# EAGLE design amc7135-24mm-RGBW-led-driver-with-butt-mk-1.1 (EAGLE 7.5.0)
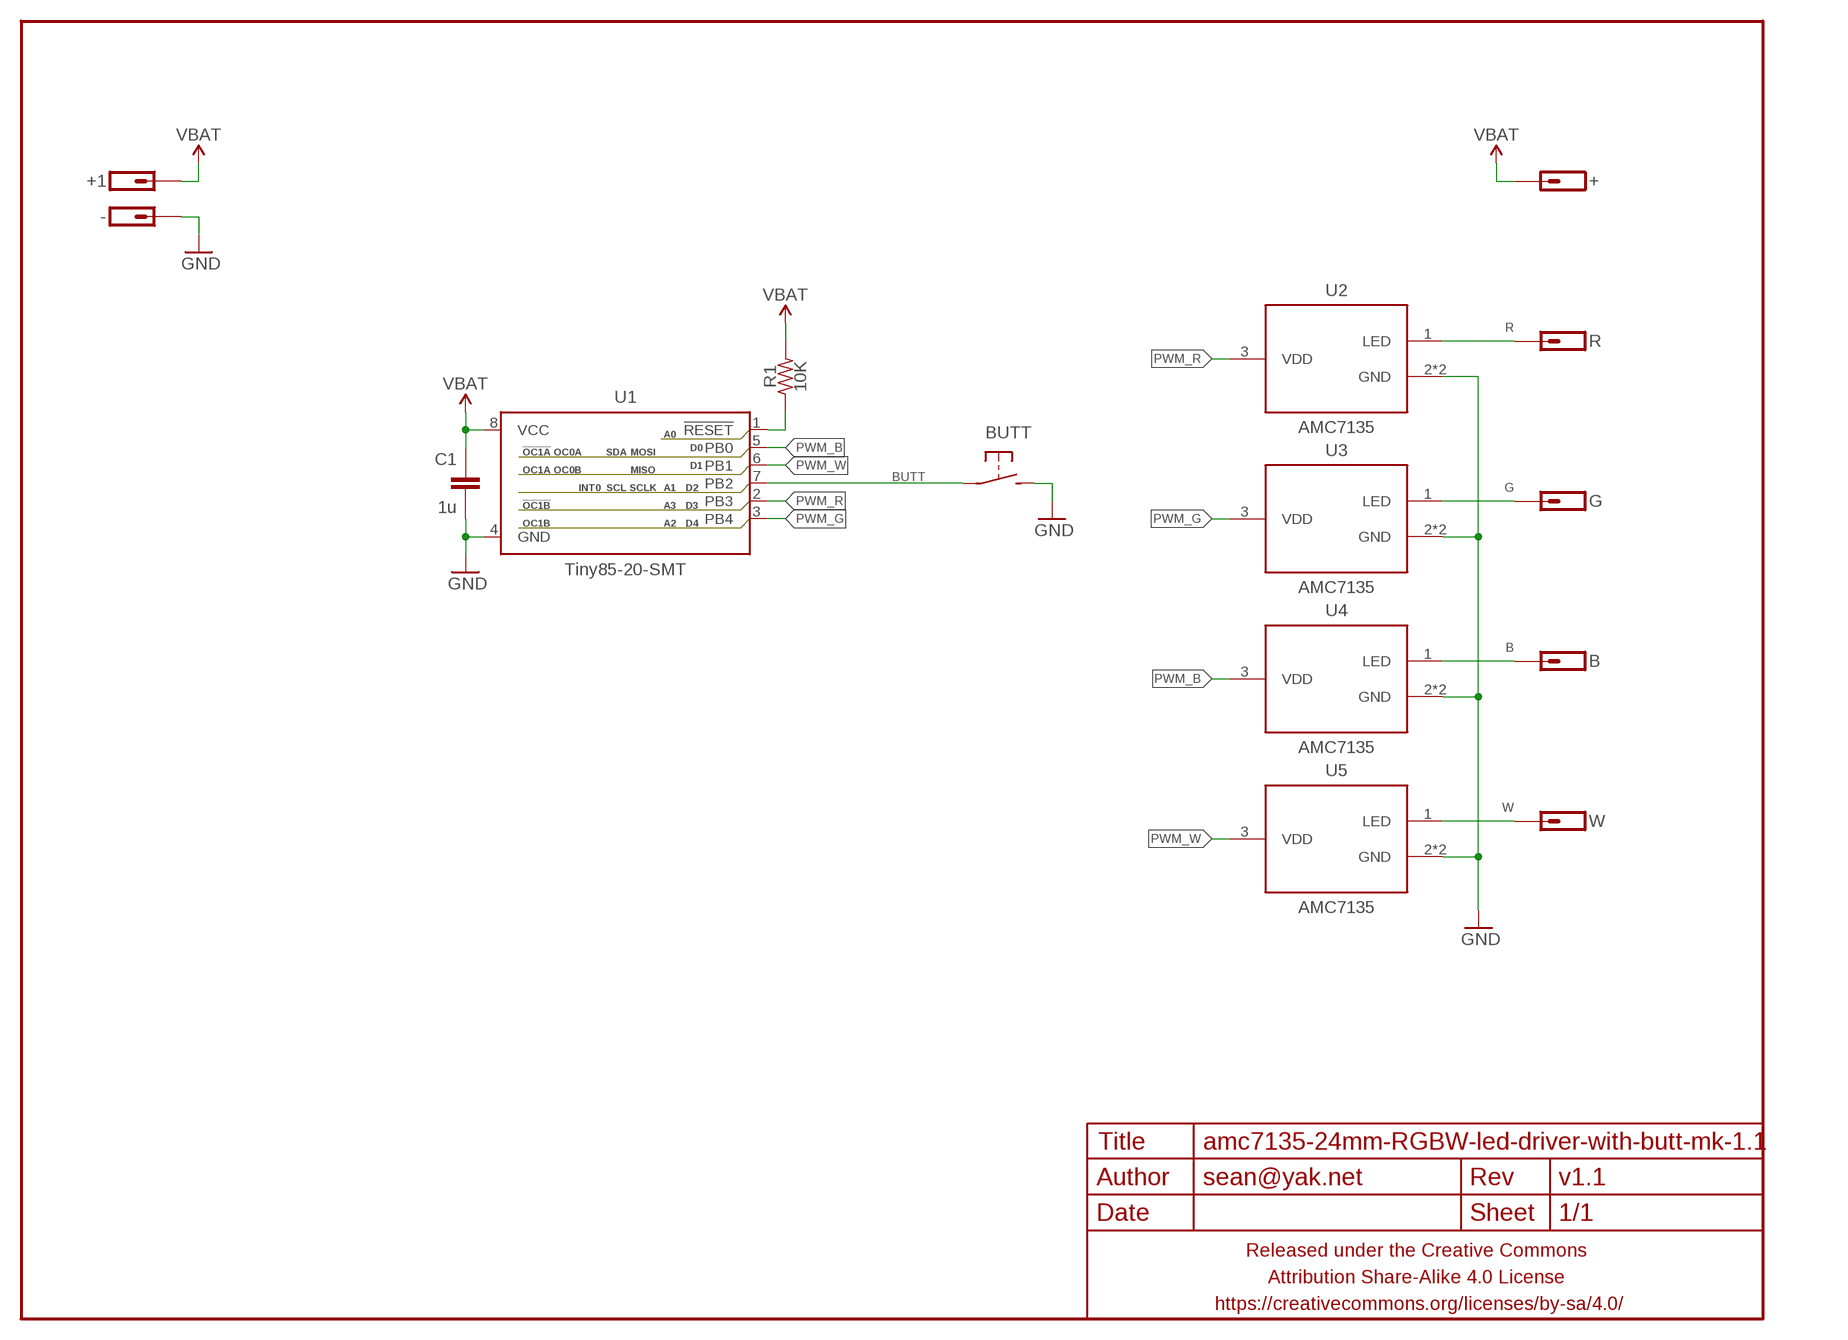
[diagram p0: schematic, sheet 1]

## Parts
+  M01PTH-1.2MM-NS  [1X01-1.2MM-NS]
+1  M01NOSTOP-CANTSTOP-DONTKNOWHOWTOSTOP  [1X01_SMD_NOSTOP_NOSILK]
-  M01NOT-A-VIA-NOPE  [1X01_NOSILK_NOSTOP]
B  M01SMD-1.25MM-DIA  [1X01-SMD-1.25MM-DIA-NS]
BUTT  SPST-NO-TACT3MM-RA  [TACTILE-PTH-SIDE]
C1  1u  CAPACITOR-CERAMICC0603-TIGHTER  [C0603-TIGHTER]
FRAME1  FRAME-LETTERNO_PACKAGE  [DUMMY]
G  M01SMD-1.25MM-DIA  [1X01-SMD-1.25MM-DIA-NS]
R  M01SMD-1.25MM-DIA  [1X01-SMD-1.25MM-DIA-NS]
R1  10K  RESISTORR0603-TIGHTER  [R0603-TIGHTER]
U1  Tiny85-20-SMT  ATTINY45TINY85-20-SOICW  [SO08-EIAJ]
U2  AMC7135  AMC7135SOT-89  [SOT89]
U3  AMC7135  AMC7135SOT-89  [SOT89]
U4  AMC7135  AMC7135SOT-89  [SOT89]
U5  AMC7135  AMC7135SOT-89  [SOT89]
W  M01SMD-1.25MM-DIA  [1X01-SMD-1.25MM-DIA-NS]

## Nets
B: B.P$1 U4.1(LED)
BUTT: BUTT.1 U1.7(PB2)
G: G.P$1 U3.1(LED)
GND: -.P$1 BUTT.2 C1.2 U1.4(GND) U2.2(GND) U2.4(GND) U3.2(GND) U3.4(GND) U4.2(GND) U4.4(GND) U5.2(GND) U5.4(GND)
N$4: R1.1 U1.1(!RESET)
PWM_B: U1.5(PB0) U4.3(VDD)
PWM_G: U1.3(PB4) U3.3(VDD)
PWM_R: U1.2(PB3) U2.3(VDD)
PWM_W: U1.6(PB1) U5.3(VDD)
R: R.P$1 U2.1(LED)
VBAT: +1.1 +.P$1 C1.1 R1.2 U1.8(VCC)
W: U5.1(LED) W.P$1

## Library data of the parts
+ +1 - B G R W = a_parts:M01: Header 1 Standard 1-pin 0.1" header. Use with straight break away headers (SKU : PRT-00116), right angle break away headers (PRT-00553), swiss pins (PRT-00743), machine pins (PRT-00117), and female headers (PRT-00115).
BUTT = a_parts:SPST-NO-TACT
C1 = a_parts:CAPACITOR-CERAMIC: CAPACITOR, European symbol
FRAME1 = a_parts:FRAME-LETTER: Schematic Frame Standard 8.5x11 US Letter frame; DESIGNER: sean@yak.net; VERSION: v1.1
R1 = a_parts:RESISTOR: RESISTOR, American symbol
U1 = a_parts:ATTINY45: Atmel 8-pin 2/4/8kB flash uC; PROD_ID: IC-09092
U2-U5 = a_parts:AMC7135

## Board
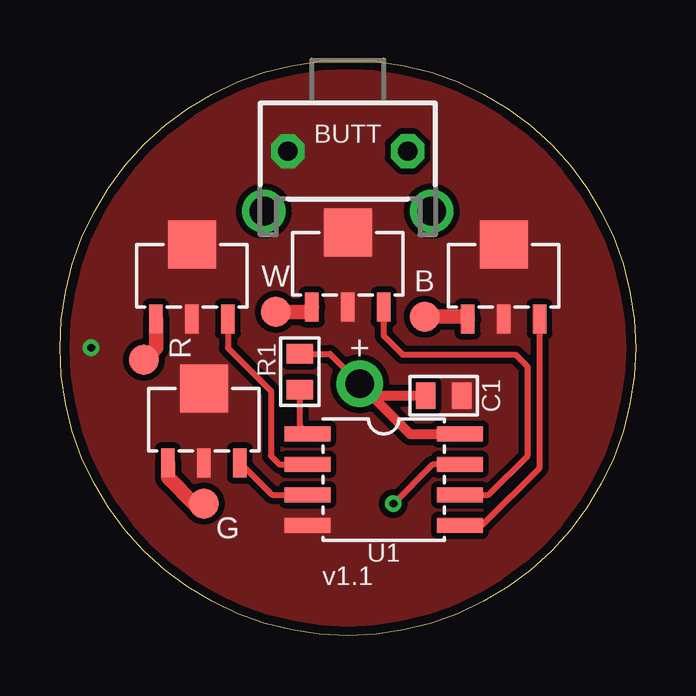
[diagram p1: board, top side]
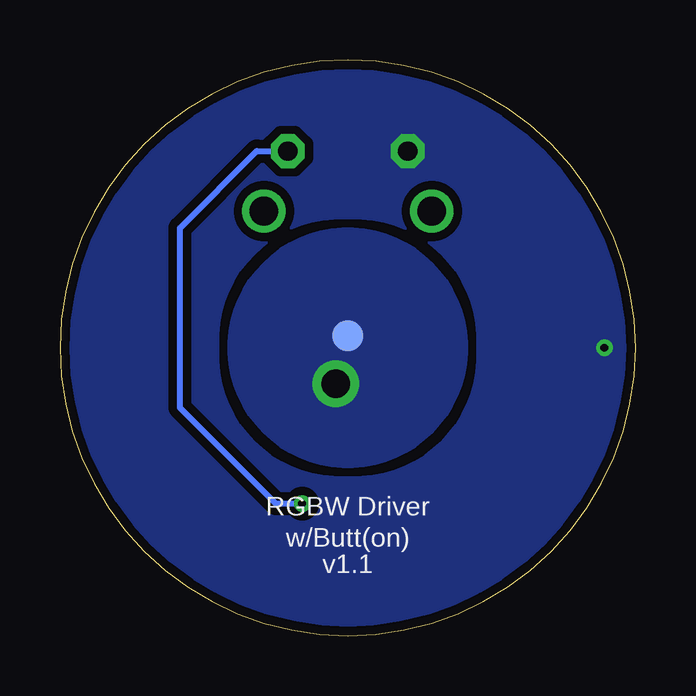
[diagram p2: board, bottom side, seen from below]

Size 24 x 24 mm. Coordinates in mm from the lower left corner, seen from the top.
Outline: 0,12 arc-180 24,12 arc-180 0,12
Copper layers (1*16): Top 0.0356mm / dielectric 1.5011mm / Bottom 0.0356mm
Design rules "LaenPCBOrder2": minimum track width 6mil, minimum drill 13mil, track to track 6mil, track to pad 6mil, pad to pad 6mil, via to via 6mil, smd to smd 6mil, copper to edge 15mil, drill to drill 6mil, minimum pad ring 7mil, minimum via ring 7mil, stop-mask expansion 3mil, vias tented up to drill 20mil, thermal gap 10mil

### Footprints (pad centres in the part's own frame; a part is rotated, then mirrored left to right if it is on the bottom)
1X01-1.2MM-NS = drill 1.2 pad 1.93: P$1 0,0
1X01_SMD_NOSTOP_NOSILK = smd 1.27 x 1.27: 1 0,0
1X01_NOSILK_NOSTOP = drill 0.33: P$1 0,0
1X01-SMD-1.25MM-DIA-NS = smd 1.25 x 1.25: P$1 0,0
TACTILE-PTH-SIDE = drill 0.8 pad 1.4 octagon: 1 -2.5,0; 2 2.5,0 | drill 1.2 pad 1.778: ANCHOR1 -3.5,2.5; ANCHOR2 3.5,2.5
C0603-TIGHTER = smd 0.8 x 1.1: 1 -0.75,0; 2 0.75,0
R0603-TIGHTER = smd 0.8 x 1.1: 1 -0.75,0; 2 0.75,0
SO08-EIAJ = smd 0.61 x 1.905: 1 -1.905,-3.175; 2 -0.635,-3.175; 3 0.635,-3.175; 4 1.905,-3.175; 5 1.905,3.175; 6 0.635,3.175; 7 -0.635,3.175; 8 -1.905,3.175
SOT89 = smd 0.58 x 1.2: 1 -1.5,-1.8; 2 0,-1.8; 3 1.5,-1.8 | smd 2 x 2: 4 0,1.3

### Placement (x,y rotation side)
+  12.5,10.5 90 top
+1  12,12.5 0 bottom
-  1.3,12 90 bottom
B  15.2,13.3 90 top
BUTT  12,20.2 180 top
C1  16,10 0 top
FRAME1  0,0 0 top
G  6,5.5 180 top
R  3.5,11.5 90 top
R1  10,11 90 top
U1  13.5,6.5 270 top
U2  5.5,15 0 top
U3  6,9 0 top
U4  18.5,15 0 top
U5  12,15.5 0 top
W  9,13.5 270 top

### Tracks (layer width: path | path; a pad name or v marks a point on that pad's centre or on a via)
B
  Top 0.6: U4.1 16.9,13.3 B.P$1
BUTT  (via drill 0.33)
  Top 0.254: U1.7 15.54,7.13 v13.9,5.5
  Bottom 0.254: v13.9,5.5 15,5.5 19,9.5 19,17 15.8,20.2 BUTT.1
G
  Top 0.6: U3.1 4.5,6.6 5.6,5.5 G.P$1
GND
  pour Top (isolate 0.25, rank 6, no thermals): 0,0 24,0 24,24 0,24
  pour Bottom (isolate 0.35, rank 6, no thermals): 0,0 0,24 24,24 24,0
N$4
  Top 0.254: U1.1 10,8.73 R1.1
PWM_B
  Top 0.254: U1.5 17.59,4.59 20,7 U4.3
PWM_G
  Top 0.254: U3.3 8.84,5.87 U1.3
PWM_R
  Top 0.254: U2.3 7,12 8.8,10.2 8.8,7.5 9.16,7.13 U1.2
PWM_W
  Top 0.254: U1.6 17.86,5.87 19.5,7.5 19.5,11.2 19,11.7 14.3,11.7 13.5,12.5 U5.3
R
  Top 0.6: U2.1 4,12 R.P$1
VBAT
  Top 0.254: R1.2 11.25,11.75 +.P$1
  Top 0.406: +.P$1 12.7,10.3 13,10 | 13,10 14.6,8.4 U1.8 | C1.1 13,10
  pour Bottom (isolate 0.305, no thermals): 8.5,15.5 arc-90 15.5,15.5 arc-90 15.5,8.5 arc-90 8.5,8.5 arc-90
W
  Top 0.6: W.P$1 10.3,13.5 U5.1

### Text on the board
bPlace: RGBW Driver | w/Butt(on)